# EAGLE design SparkFun_GNSS_NEO-M9N (EAGLE 9.6.2)
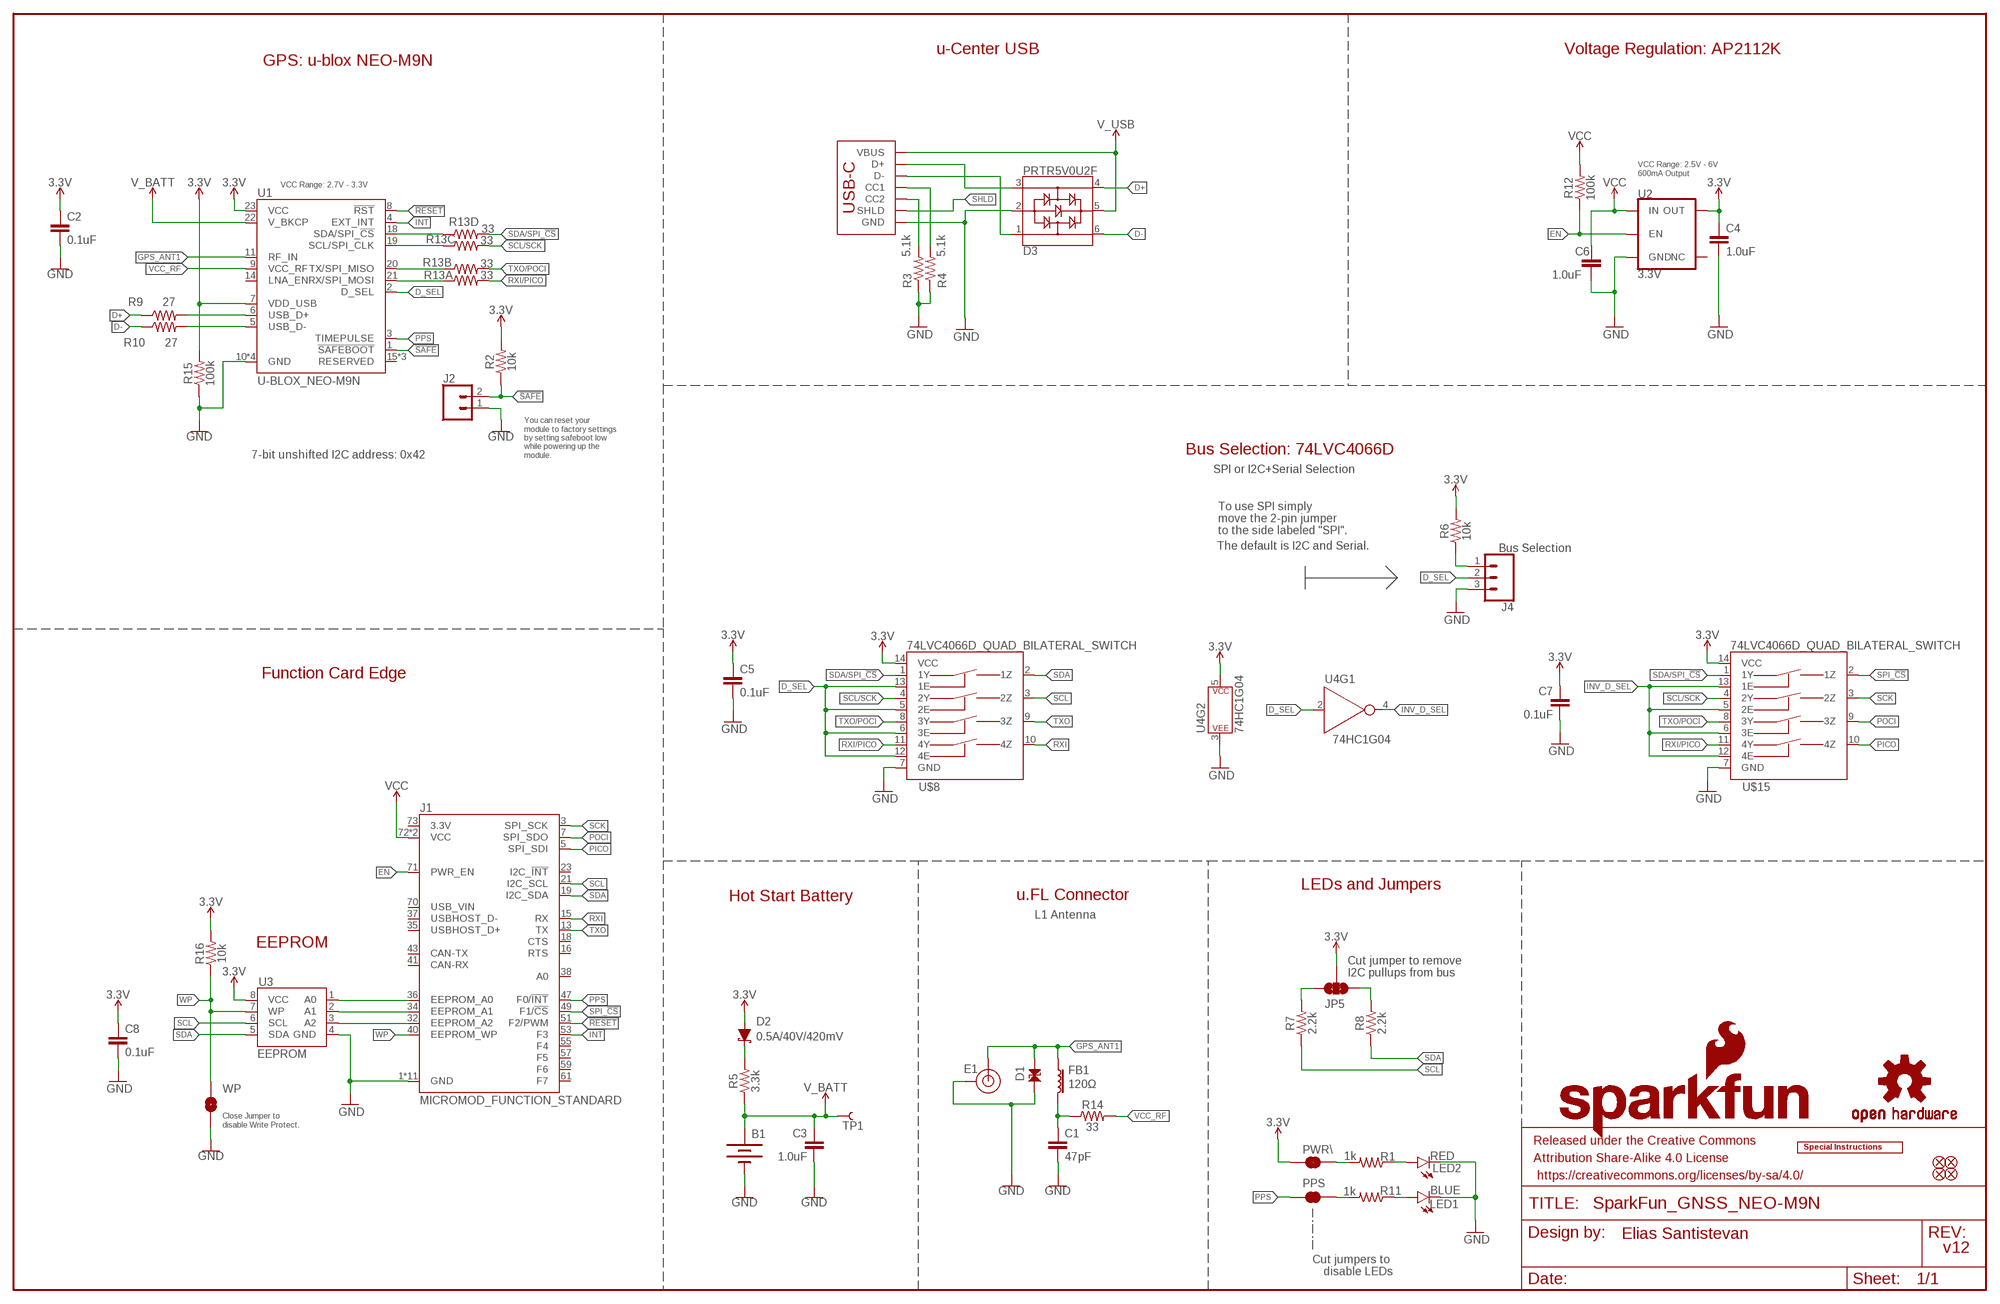
[diagram p0: schematic, sheet 1]

## Parts
B1  6.8MM_COIN_CELL  RELOWABLE_BATTERY_MS421R  [MS421R_IV03E]
C1  47pF  47PF-0402-25V-5%-X7R  [0402]
C2  0.1uF  0.1UF-0402T-16V-10%  [0402-TIGHT]
C3  1.0uF  1.0UF-0603-16V-10%  [0603]
C4  1.0uF  1.0UF-0603-16V-10%  [0603]
C5  0.1uF  0.1UF-0603-25V-(+80/-20%)  [0603]
C6  1.0uF  1.0UF-0603-16V-10%  [0603]
C7  0.1uF  0.1UF-0603-25V-(+80/-20%)  [0603]
C8  0.1uF  0.1UF-0603-25V-(+80/-20%)  [0603]
D1  PESD0402-0402T  [0402-TIGHT]
D2  0.5A/40V/420mV  DIODE-SCHOTTKY-PMEG4005EJ  [SOD-323]
D3  PRTR5V0U2F  [SOT886]
E1  U.FL  U.FL2PIN  [U.FL]
FB1  120Ω  FERRITE_BEAD-120_OHM-0402  [0402]
FD1  FIDUCIAL1X2  [FIDUCIAL-1X2]
FD2  FIDUCIAL1X2  [FIDUCIAL-1X2]
FD3  FIDUCIAL1X2  [FIDUCIAL-1X2]
FD4  FIDUCIAL1X2  [FIDUCIAL-1X2]
FRAME2  FRAME-LEDGER  [CREATIVE_COMMONS]
J1  MICROMOD_FUNCTION_STANDARD  [M.2-CARD-E-22_FUNCTION_STANDARD]
J2  CONN_02  [1X02]
J3  USB_C_2-LAYER_PADS  [USB-C-16P-2LAYER-PADS]
J4  Bus Selection  CONN_03LOCK  [1X03_LOCK]
JP5  JUMPER-SMT_3_2-NC_TRACE_SILK  [SMT-JUMPER_3_2-NC_TRACE_SILK]
LED1  BLUE  LED-BLUE0603  [LED-0603]
LED2  RED  LED-RED0603  [LED-0603]
LOGO1  SPECIAL_INSTRUCTIONS-ORDERING  [ORDERING_INSTRUCTIONS]
LOGO2  SFE_LOGO_NAME_FLAME.2_INCH  [SFE_LOGO_NAME_FLAME_.2]
LOGO3  OSHW-LOGOS  [OSHW-LOGO-S]
PPS  JUMPER-SMT_2_NC_TRACE_SILK  [SMT-JUMPER_2_NC_TRACE_SILK]
PWR\  JUMPER-SMT_2_NC_TRACE_SILK  [SMT-JUMPER_2_NC_TRACE_SILK]
R1  1k  1KOHM-0603-1/10W-1%  [0603]
R2  10k  10KOHM-0603-1/10W-1%  [0603]
R3  5.1k  5.1KOHM5.1KOHM-0603-1/10W-1%  [0603]
R4  5.1k  5.1KOHM5.1KOHM-0603-1/10W-1%  [0603]
R5  3.3k  3.3KOHM-0603-1/10W-1%  [0603]
R6  10k  10KOHM-0603-1/10W-1%  [0603]
R7  2.2k  2.2KOHM-0603-1/10W-1%  [0603]
R8  2.2k  2.2KOHM-0603-1/10W-1%  [0603]
R9  27  27OHM-0603-1/10W-1%  [0603]
R10  27  27OHM-0603-1/10W-1%  [0603]
R11  1k  1KOHM-0603-1/10W-1%  [0603]
R12  100k  100KOHM-0603-1/10W-1%  [0603]
R13  33  33OHM_RA-1206-1/16W-5%  [1206_RA]
R14  33  33OHM-0402-1/10W-1%  [0402]
R15  100k  100KOHM-0603-1/10W-1%  [0603]
R16  10k  10KOHM-0603-1/10W-1%  [0603]
TP1  TEST-POINT3X4  [PAD.03X.04]
U1  U-BLOX_NEO-M9N  [NEO-M9N/M8T/M8U/D9S]
U2  3.3V  V_REG_AP2112K-3.3V  [SOT23-5]
U3  EEPROM  EEPROM-I2C512K  [SO08]
U4  74HC1G04  [SOT353]
U$8  74LVC4066D_QUAD_BILATERAL_SWITCH  [SO14]
U$15  74LVC4066D_QUAD_BILATERAL_SWITCH  [SO14]
WP  JUMPER-SMT_2_NO_SILK  [SMT-JUMPER_2_NO_SILK]

## Nets
3.3V [3.3V]: C2.1 C4.1 C5.1 C7.1 C8.1 D2.A JP5.2 PWR\.2 R2.2 R6.2 R15.2 R16.2 U1.7(VDD_USB) U1.23(VCC) U2.5(OUT) U3.8(VCC) U4.5(P$V+) U$8.14(VCC) U$15.14(VCC)
!RESET: J1.51(F2/PWM) U1.8(!RST)
!SAFE: J2.2 R2.1 U1.1(!SAFEBOOT!)
A0: J1.36(EEPROM_A0) U3.1(A0)
A1: J1.34(EEPROM_A1) U3.2(A1)
A2: J1.32(EEPROM_A2) U3.3(A2)
D+: D3.4 R9.1
D-: D3.6 R10.1
D_SEL: J4.2 U1.2(D_SEL) U4.2(A) U$8.5(2E) U$8.6(3E) U$8.12(4E) U$8.13(1E)
EN: J1.71(PWR_EN) R12.1 U2.3(EN)
GND: B1.- C1.2 C2.2 C3.2 C4.2 C5.2 C6.2 C7.2 C8.2 D1.1 D3.2 E1.1(GND) E1.2(GND) J1.1(GND) J1.33(GND) J1.39(GND) J1.45(GND) J1.75(GND) J1.GND1(GND) J1.GND2(GND) J1.GND3(GND) J1.GND4(GND) J1.GND5(GND) J1.GND6(GND) J2.1 J3.GND J3.GND2(GND) J4.3 LED1.C LED2.C R3.1 R4.1 R15.1 U1.10(GND) U1.12(GND) U1.13(GND) U1.24(GND) U2.2(GND) U3.4(GND) U4.3(P$V-) U$8.7(GND) U$15.7(GND) WP.1
GPS_ANT1 [Antenna]: D1.2 E1.FEED(SIGNAL) FB1.1 U1.11(RF_IN)
INT: J1.53(F3) U1.4(EXT_INT)
INV_D_SEL: U4.4(Y) U$15.5(2E) U$15.6(3E) U$15.12(4E) U$15.13(1E)
N$1: PWR\.1 R1.2
N$2: LED1.A R11.1
N$3: C1.1 FB1.2 R14.1
N$4: PPS.1 R11.2
N$5: JP5.1 R8.2
N$6: D2.C R5.2
N$7: J3.A5(CC1) R4.2
N$8: JP5.3 R7.2
N$9: J3.B5(CC2) R3.2
N$10: LED2.A R1.1
N$11: R9.2 U1.6(USB_D+)
N$12: R10.2 U1.5(USB_D-)
N$13 [3.3V]: J4.1 R6.1
PICO: J1.5(SPI_SDI) U$15.10(4Z)
POCI: J1.7(SPI_SDO) U$15.9(3Z)
PPS: J1.47(F0/!INT!) PPS.2 U1.3(TIMEPULSE)
RXI: J1.15(RX) U$8.10(4Z)
RXI/PICO: R13.P8 U$8.11(4Y) U$15.11(4Y)
RXLV: R13.P1 U1.21(RX/SPI_MOSI)
SCK: J1.3(SPI_SCK) U$15.3(2Z)
SCL: J1.21(I2C_SCL) R7.1 U3.6(SCL) U$8.3(2Z)
SCL/SCK: R13.P6 U$8.4(2Y) U$15.4(2Y)
SCL_LV: R13.P3 U1.19(SCL/SPI_CLK)
SDA: J1.19(I2C_SDA) R8.1 U3.5(SDA) U$8.2(1Z)
SDA/SPI_!CS!: R13.P5 U$8.1(1Y) U$15.1(1Y)
SDA_LV: R13.P4 U1.18(SDA/SPI_!CS!)
SHLD: J3.SHLD1(SHLD) J3.SHLD2(SHLD) J3.SHLD3(SHLD) J3.SHLD4(SHLD)
SPI_!CS!: J1.49(F1/!CS!) U$15.2(1Z)
TXLV: R13.P2 U1.20(TX/SPI_MISO)
TXO: J1.13(TX) U$8.9(3Z)
TXO/POCI: R13.P7 U$8.8(3Y) U$15.8(3Y)
USB_D+: D3.3 J3.A6(D+) J3.B6(D+)
USB_D-: D3.1 J3.A7(D-) J3.B7(D-)
V_BATT: B1.+ C3.1 R5.1 TP1.1 U1.22(V_BKCP)
V_USB: D3.5 J3.VBUS1(VBUS) J3.VBUS2(VBUS)
VCC: C6.1 J1.72(VCC) J1.74(VCC) R12.2 U2.1(IN)
VCC_RF: R14.2 U1.9(VCC_RF)
WP: J1.40(EEPROM_WP) R16.1 U3.7(WP) WP.2
Unconnected: J1.16(RTS) J1.18(CTS) J1.23(I2C_!INT!) J1.35(USBHOST_D+) J1.37(USBHOST_D-) J1.38(A0) J1.41(CAN-RX) J1.43(CAN-TX) J1.55(F4) J1.57(F5) J1.59(F6) J1.61(F7) J1.70(USB_VIN) J1.73(3.3V) U1.14(LNA_EN) U1.15(RESERVED) U1.16(RESERVED) U1.17(RESERVED) U2.4(NC)

## Notes on the sheet
- u-Center USB | Voltage Regulation: AP2112K
- GPS: u-blox NEO-M9N
- VCC Range: 2.5V - 6V 
  600mA Output
- VCC Range: 2.7V - 3.3V
- 7-bit unshifted I2C address: 0x42 | Bus Selection: 74LVC4066D
- You can reset your 
  module to factory settings
  by setting safeboot low
  while powering up the
  module.
- SPI or I2C+Serial Selection
- To use SPI simply 
  move the 2-pin jumper
  to the side labeled "SPI".
- The default is I2C and Serial.
- Function Card Edge
- LEDs and Jumpers
- Hot Start Battery | u.FL Connector
- L1 Antenna
- EEPROM
- Cut jumper to remove 
  I2C pullups from bus
- Close Jumper to
  disable Write Protect.
- Elias Santistevan
- v12
- Cut jumpers to 
  disable LEDs

## Library data of the parts
B1 = SparkFun-Batteries:RELOWABLE_BATTERY: SEIKO Reflowable Lithium Batteries; PROD_ID: BAT-16685
C1 = SparkFun-Capacitors:47PF: 47pF ceramic capacitors A capacitor is a passive two-terminal electrical component used to store electrical energy temporarily in an electric field.; PROD_ID: CAP-15063
C2 = SparkFun-Capacitors:0.1UF: 0.1µF ceramic capacitors A capacitor is a passive two-terminal electrical component used to store electrical energy temporarily in an electric field.; PROD_ID: CAP-12416
C3 C4 C6 = SparkFun-Capacitors:1.0UF: 1µF ceramic capacitors A capacitor is a passive two-terminal electrical component used to store electrical energy temporarily in an electric field.; PROD_ID: CAP-00868
C5 C7 C8 = SparkFun-Capacitors:0.1UF: 0.1µF ceramic capacitors A capacitor is a passive two-terminal electrical component used to store electrical energy temporarily in an electric field.; PROD_ID: CAP-00810
D1 = SparkFun-DiscreteSemi:PESD0402: ESD protection diode PESD is used to protect a signal line from ESD.; PROD_ID: DIO-15359
D2 = SparkFun-DiscreteSemi:DIODE-SCHOTTKY: Schottky diode A Schottky diode is a semiconductor diode which has a low forward voltage drop and a very fast switching action.; PROD_ID: DIO-10955
D3 = SparkFun-IC-Power:PRTR5V0U2: A small ESD protection device. Most commonly used on USB D+/D- signals to protect large, expensive, or especially sensitive USB enabled devices.; PROD_ID: DIO-14084
E1 = SparkFun-Connectors:U.FL2PIN: SMD Antenna Connector - U.FL 2mm height, 3.0mm x 3.0mm receptacle size. SparkFun Products: SparkFun WiFi Shield - ESP8266 <https://www.sparkfun.com/products/13287> SparkFun ESP8266 Thing <https://www.sparkfun.com/products/13231> SparkFun MiniGen - Pro Mini Signal Generator Shield <https://www.sparkfun.com/products/11420>; PROD_ID: CONN-09193; SF_ID: WRL-09144
FB1 = SparkFun-Coils:FERRITE_BEAD-120_OHM: Ferrite Bead (blocks, cores, rings, chokes, etc.) Inductor with layers of ferrite used to suppress high frequencies. Often used to isolate high frequency noise.; MFG_PART: BLM15HB121SN1D; PROD_ID: NDUC-14206
FD1-FD4 = SparkFun-Aesthetics:FIDUCIAL: Fiducial Alignment Points Point-of-reference for pick-and-place machines and other optical instruments.
FRAME2 = SparkFun-Aesthetics:FRAME-LEDGER: Schematic Frame - Ledger Standard 11x14 US Ledger frame
J1 = SparkFun-MicroMod:MICROMOD_FUNCTION: MicroMod Connector Description: A card edge connector and mating PCB connector to allow various MicroMod Processor Boards to be coupled with various carrier boards of different capabilities. Based on the M.2 standard.
J2 = SparkFun-Connectors:CONN_02: Multi connection point. Often used as Generic Header-pin footprint for 0.1 inch spaced/style header connections On any of the 0.1 inch spaced packages, you can populate with these: Break Away Headers - Straight <https://www.sparkfun.com/products/116> (PRT-00116) Break Away Male Headers - Right Angle <https://www.sparkfun.com/products/553> (PRT-00553) Female Headers <https://www.sparkfun.com/products/115> (PRT-00115) Break Away Headers - Machine Pin <https://www.sparkfun.com/products/117> (PRT-00117) Break Away Female Headers - Swiss Machine Pin <https://www.sparkfun.com/products/743> (PRT-00743) For SCREWTERMINALS and SPRING TERMINALS visit here: Screw Terimnals on SparkFun.com <https://www.sparkfun.com/search/results?term=Screw+Terminals> (5mm/3.5mm/2.54mm spacing) This device is also useful as a general connection point to wire up your design to another part of your project. Our various solder wires solder well into these plated through hole pads. Hook-Up Wire - Assortment (Stranded, 22 AWG) <https://www.sparkfun.com/products/11375> (PRT-11375) Hook-Up Wire - Assortment (Solid Core, 22 AWG) <https://www.sparkfun.com/products/11367> (PRT-11367) View the entire wire category on our website here <https://www.sparkfun.com/categories/141> Special notes: Molex polarized connector foot print use with: PRT-08233 with associated crimp pins and housings. 2.54_SCREWTERM for use with PRT-10571. 3.5mm Screw Terminal footprints for PRT-08084 5mm Screw Terminal footprints for use with PRT-08432
J3 = SparkFun-Connectors:USB_C: USB Type C 16Pin Connector Super Speed pins not available on the 16-pin purely SMD connector so this part is best for USB 2.0 implementations. D1 and D2 are tied together enabling D+/- no matter which way the cable is plugged into the connector. The two channel configuration pins (CC1/2) are exposed. These are normally connected to ground via 5.1k resistors but can be reconfigured for high current/high power applications. **4-LAYER BOARD WARNING!!** If designing 4-layer board, make sure to select the variant _4-LAYER-ISOLATED. The linked footprint (USB-C-16-4LAYER-ISOLATED) includes some very necessary cutout polygons in the inner layers (2 and 15). This prevents the PTH mounting shield legs on the USB connector from electrically connecting any other polygons on the inner layers (usually VCC and GND).; PROD_ID: CONN-14122
J4 = SparkFun-Connectors:CONN_03: Multi connection point. Often used as Generic Header-pin footprint for 0.1 inch spaced/style header connections On any of the 0.1 inch spaced packages, you can populate with these: Break Away Headers - Straight <https://www.sparkfun.com/products/116> (PRT-00116) Break Away Male Headers - Right Angle <https://www.sparkfun.com/products/553> (PRT-00553) Female Headers <https://www.sparkfun.com/products/115> (PRT-00115) Break Away Headers - Machine Pin <https://www.sparkfun.com/products/117> (PRT-00117) Break Away Female Headers - Swiss Machine Pin <https://www.sparkfun.com/products/743> (PRT-00743) Stackable Header - 3 Pin (Female, 0.1") <https://www.sparkfun.com/products/13875> (PRT-13875) For SCREWTERMINALS and SPRING TERMINALS visit here: Screw Terimnals on SparkFun.com <https://www.sparkfun.com/search/results?term=Screw+Terminals> (5mm/3.5mm/2.54mm spacing) This device is also useful as a general connection point to wire up your design to another part of your project. Our various solder wires solder well into these plated through hole pads. Hook-Up Wire - Assortment (Stranded, 22 AWG) <https://www.sparkfun.com/products/11375> (PRT-11375) Hook-Up Wire - Assortment (Solid Core, 22 AWG) <https://www.sparkfun.com/products/11367> (PRT-11367) View the entire wire category on our website here <https://www.sparkfun.com/categories/141> Special notes: Molex polarized connector foot print use with SKU : PRT-08232 with associated crimp pins and housings.
JP5 = SparkFun-Jumpers:JUMPER-SMT_3_2-NC_TRACE: Normally closed trace jumper (2 of 2 connections) This jumper has a trace between all three pads so they are normally closed (NC). Use a razor knife to open the connection(s). For best results follow the IPC guidelines for cutting traces: Cutout at least 0.063 mm (0.005 in). Remove all loose material to clean up the cut area. Seal the cut with an approved epoxy. Reapply solder to reclose the connection(s).
LED1 = SparkFun-LED:LED-BLUE: Blue SMD LED Used in manufacturing of various products at SparkFun Packages: 0603 - SMD 0603 package [Product Link] <http://www.digikey.com/product-detail/en/SMLE12BC7TT86/511-1589-2-ND/1641808> 1206 - SMD1206 package [Product Link] <http://www.digikey.com/product-detail/en/lite-on-inc/LTST-C150TBKT/160-1643-1-ND/573584> SparkFun Products: ESP8266 Thing-Dev Board <https://www.sparkfun.com/products/13711> RedBoard <https://www.sparkfun.com/products/12757>; PROD_ID: DIO-08575
LED2 = SparkFun-LED:LED-RED: Red SMD LED Used in manufacturing of most products at SparkFun Packages: 0603 - SMD 0603 package [Product Link] <http://docs.avagotech.com/docs/AV02-0551EN> 0603 SMART - SMD 0603 SMART package ( more efficient and expensive)[Product Link] <http://www.osram-os.com/Graphics/XPic2/00077099_0.pdf> 1206 - SMD1206 package [Product Link] <https://www.sparkfun.com/datasheets/DevTools/LilyPad/Q150OVS4.pdff> SparkFun Products: Pro Mini 328 -5V <https://www.sparkfun.com/products/821> RedBoard <https://www.sparkfun.com/products/12757> IOIO-OTG <https://www.sparkfun.com/products/13613>; PROD_ID: DIO-00819
LOGO1 = SparkFun-Aesthetics:SPECIAL_INSTRUCTIONS: Special Ordering/Production Instructions Alert Symbol for special PCB ordering instructions or unique production process warnings. Ordering Instructions Production Instructions Types of information that should be added to box: Copper weight Soldermask color Silk color PCB thickness Number of layers PCB Standard: 1.6mm FR4 1 oz copper immersion silver plating red soldermask white silkscreen Types of information that should be added to box: Special wash requirements Depaneling instructions Humidification Glue curing Default text settings: 0.07 inch 9% ratio 50% line distance
LOGO2 = SparkFun-Aesthetics:SFE_LOGO_NAME_FLAME: SparkFun Font Logo w/ Flame This is the SparkFun full logo. The logo on the schematic will always be the same size; the package variant is the height of the flame part of the logo. Default layer for the logo on the board is tSilk.
LOGO3 = SparkFun-Aesthetics:OSHW-LOGO: Open-Source Hardware (OSHW) Logo This logo indicates the piece of hardware it is found on incorporates a OSHW license and/or adheres to the definition of open source hardware found here: http://freedomdefined.org/OSHW
PPS PWR\ = SparkFun-Jumpers:JUMPER-SMT_2_NC_TRACE: Normally closed trace jumper This jumper has a trace between two pads so it's normally closed (NC). Use a razor knife to open the connection. For best results follow the IPC guidelines for cutting traces: Cutout at least 0.063 mm (0.005 in). Remove all loose material to clean up the cut area. Seal the cut with an approved epoxy. Reapply solder to reclose the connection.
R1 R11 = SparkFun-Resistors:1KOHM: 1kΩ resistor A resistor is a passive two-terminal electrical component that implements electrical resistance as a circuit element. Resistors act to reduce current flow, and, at the same time, act to lower voltage levels within circuits. - Wikipedia; PROD_ID: RES-07856
R2 R6 R16 = SparkFun-Resistors:10KOHM: 10kΩ resistor A resistor is a passive two-terminal electrical component that implements electrical resistance as a circuit element. Resistors act to reduce current flow, and, at the same time, act to lower voltage levels within circuits. - Wikipedia; PROD_ID: RES-00824
R3 R4 = SparkFun-Resistors:5.1KOHM; PROD_ID: RES-12083
R5 = SparkFun-Resistors:3.3KOHM: 3.3kΩ resistor A resistor is a passive two-terminal electrical component that implements electrical resistance as a circuit element. Resistors act to reduce current flow, and, at the same time, act to lower voltage levels within circuits. - Wikipedia; PROD_ID: RES-07851
R7 R8 = SparkFun-Resistors:2.2KOHM: 2.2kΩ resistor A resistor is a passive two-terminal electrical component that implements electrical resistance as a circuit element. Resistors act to reduce current flow, and, at the same time, act to lower voltage levels within circuits. - Wikipedia; PROD_ID: RES-08272
R9 R10 = SparkFun-Resistors:27OHM: 27Ω resistor A resistor is a passive two-terminal electrical component that implements electrical resistance as a circuit element. Resistors act to reduce current flow, and, at the same time, act to lower voltage levels within circuits. - Wikipedia; PROD_ID: RES-09334
R12 R15 = SparkFun-Resistors:100KOHM: 100kΩ resistor A resistor is a passive two-terminal electrical component that implements electrical resistance as a circuit element. Resistors act to reduce current flow, and, at the same time, act to lower voltage levels within circuits. - Wikipedia; PROD_ID: RES-07828
R13 = SparkFun-Resistors:33OHM_RA: EXB-38V330JV Four Resistory Array - AEC-Q200 Certified; PROD_ID: RES-15081
R14 = SparkFun-Resistors:33OHM: 33Ω resistor A resistor is a passive two-terminal electrical component that implements electrical resistance as a circuit element. Resistors act to reduce current flow, and, at the same time, act to lower voltage levels within circuits. - Wikipedia; PROD_ID: RES-14883
TP1 = SparkFun-Connectors:TEST-POINT: SparkFun Test Points Bare copper test points for troubleshooting or In-Circuit-Testing. These are used by our Production team for verifying production board runs using pogo-pins on test beds. SparkFun Products: SparkFun LSM9DS1 Breakout <https://www.sparkfun.com/products/13284> SparkFun PSOC <https://www.sparkfun.com/products/13714> SparkFun Load Cell Amplifier <https://www.sparkfun.com/products/13879>
U1 = SparkFun-GPS:U-BLOX_NEO-M9N: u-blox NEO-M9N GPS Module The NEO-M9N module is built on the robust u-blox M9 GNSS chip, which provides exceptional sensitivity and acquisition times for all L1 GNSS systems. The u-blox M9 standard precision GNSS platform, which delivers meter-level accuracy, succeeds the well-known u-blox M8 product range. The receiver also provides higher navigation rate and improved security features compared to previous u-blox GNSS generations. The NEO-M9N module is available in the NEO form factor LLC package; PROD_ID: IC-14651
U2 = SparkFun-IC-Power:V_REG_AP2112: AP2112 - 600mA CMOS LDO Regulator w/ Enable The AP2112 is CMOS process low dropout linear regulator with enable function, the regulator delivers a guaranteed 600mA (min.) continuous load current. Features Output Voltage Accuracy: ±1.5% Output Current: 600mA (Min.) Foldback Short Current Protection: 50mA Enable Function to Turn ON/OFF VOUT Low Dropout Voltage (3.3V): 250mV (Typ.) @IOUT=600mA Excellent Load Regulation: 0.2%/A (Typ.) Excellent Line Regulation: 0.02%/V (Typ.) Low Quiescent Current: 55μA (Typ.) Low Standby Current: 0.01μA (Typ.) Low Output Noise: 50μVRMS PSRR: 100Hz -65dB, 1kHz -65dB OTSD Protection Stable with 1.0μF Flexible Cap: Ceramic, Tantalum and Aluminum Electrolytic Operation Temperature Range: -40°C to 85°C ESD: MM 400V, HBM 4000V; PROD_ID: VREG-12457
U3 = SparkFun-IC-Memory:EEPROM-I2C: I2C EEPROMs, 24LC256 and others 24LC256 Series 256 kb I2C 2 Wire (32 k x 8 Bit) 2.5 V Serial EEPROM SMD - SOIC-8 Datasheet SparkFun Products SparkFun UDB5 - PIC UAV Development Board <https://www.sparkfun.com/products/11703> (GPS-11703); PROD_ID: IC-14645
U4 = SparkFun-IC-Logic:74*1G04: Single Inverter IC NOT GATE INVERTER SNGL 1IN SOT353 Supply: 1.65V to 5.5V Datasheet <http://diodes.com/datasheets/74LVC1G04.pdf> SparkFun Products SparkFun Stepoko <https://www.sparkfun.com/products/13899> (ROB-13899) SparkFun CryptoShield <https://www.sparkfun.com/products/13183> (DEV-13183) SparkFun LogicBlocks Kit <https://www.sparkfun.com/products/11006> (KIT-11006) SparkFun ArduMoto <https://www.sparkfun.com/products/9815> (DEV-09815); PROD_ID: COMP-08268
U$8 U$15 = SparkFun-IC-Logic:74LVC4066D_QUAD_BILATERAL_SWITCH: Nexperia Quad Bilateral Switch The 74LVC4066 is a high-speed Si-gate CMOS device. The 74LVC4066 provides four single pole, single-throw analog switch functions. Each switch has two input/output terminals (nY and nZ) and an active HIGH enable input (nE). When nE is LOW, the analog switch is turned off. Schmitt-trigger action at the enable inputs makes the circuit tolerant of slower input rise and fall times across the entire VCC range from 1.65 V to 5.5 V. Datasheet <https://assets.nexperia.com/documents/data-sheet/74LVC4066.pdf>; PROD_ID: IC-13944
WP = SparkFun-Jumpers:JUMPER-SMT_2_NO: Normally open jumper This jumper has two pads in close proximity to each other. Apply solder to close the connection. Round pads are easier to solder for beginners, but are a lot larger. SparkFun Product that uses the round pads: SparkFun EL Sequencer <https://www.sparkfun.com/products/12781>

## Net classes
0 default: width 0.203 mm
1 vcc: width 0.254 mm
2 3.3V: width 0.203 mm
3 Antenna: width 1 mm, clearance 0.3 mm

## Board
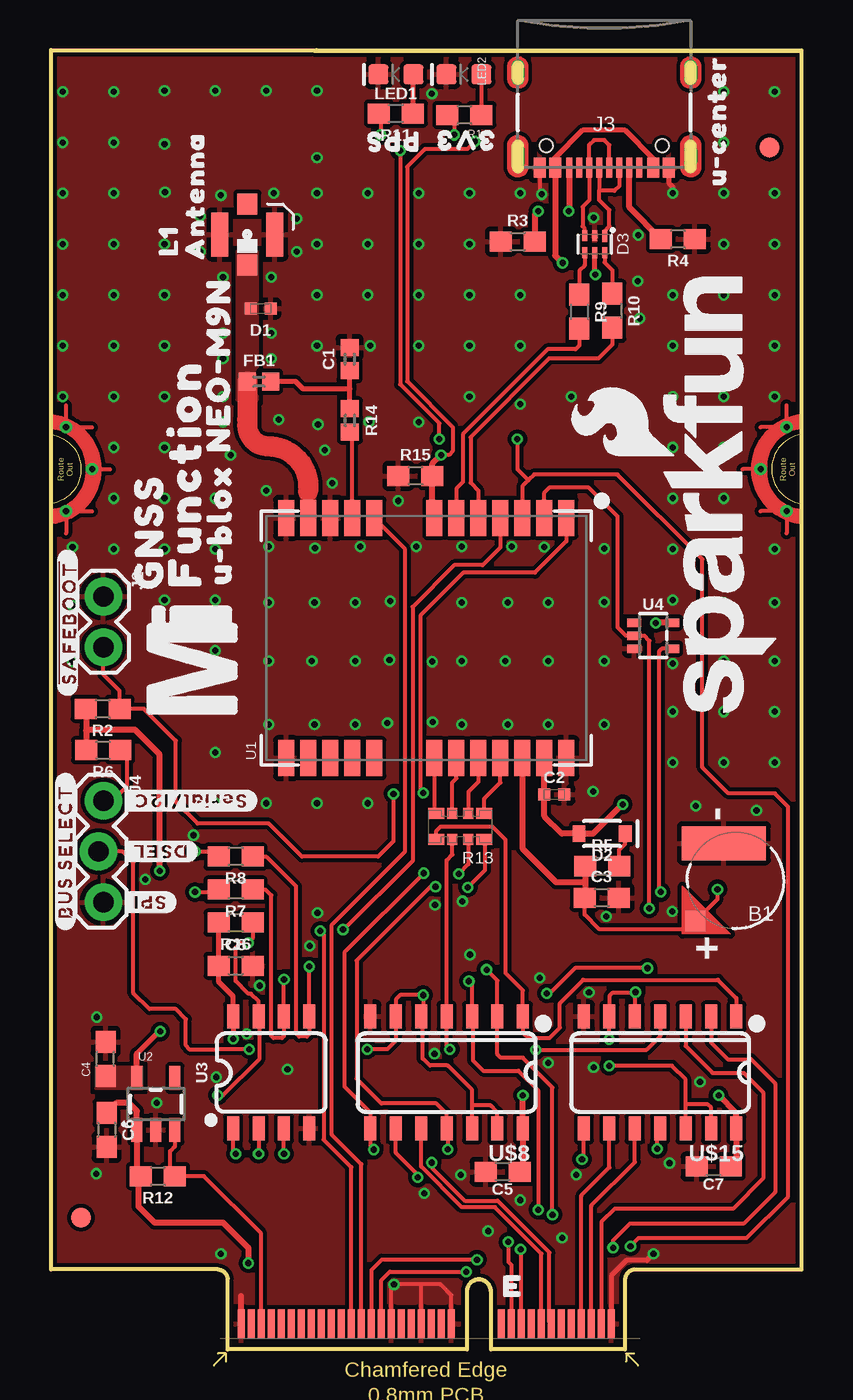
[diagram p1: board, top side]
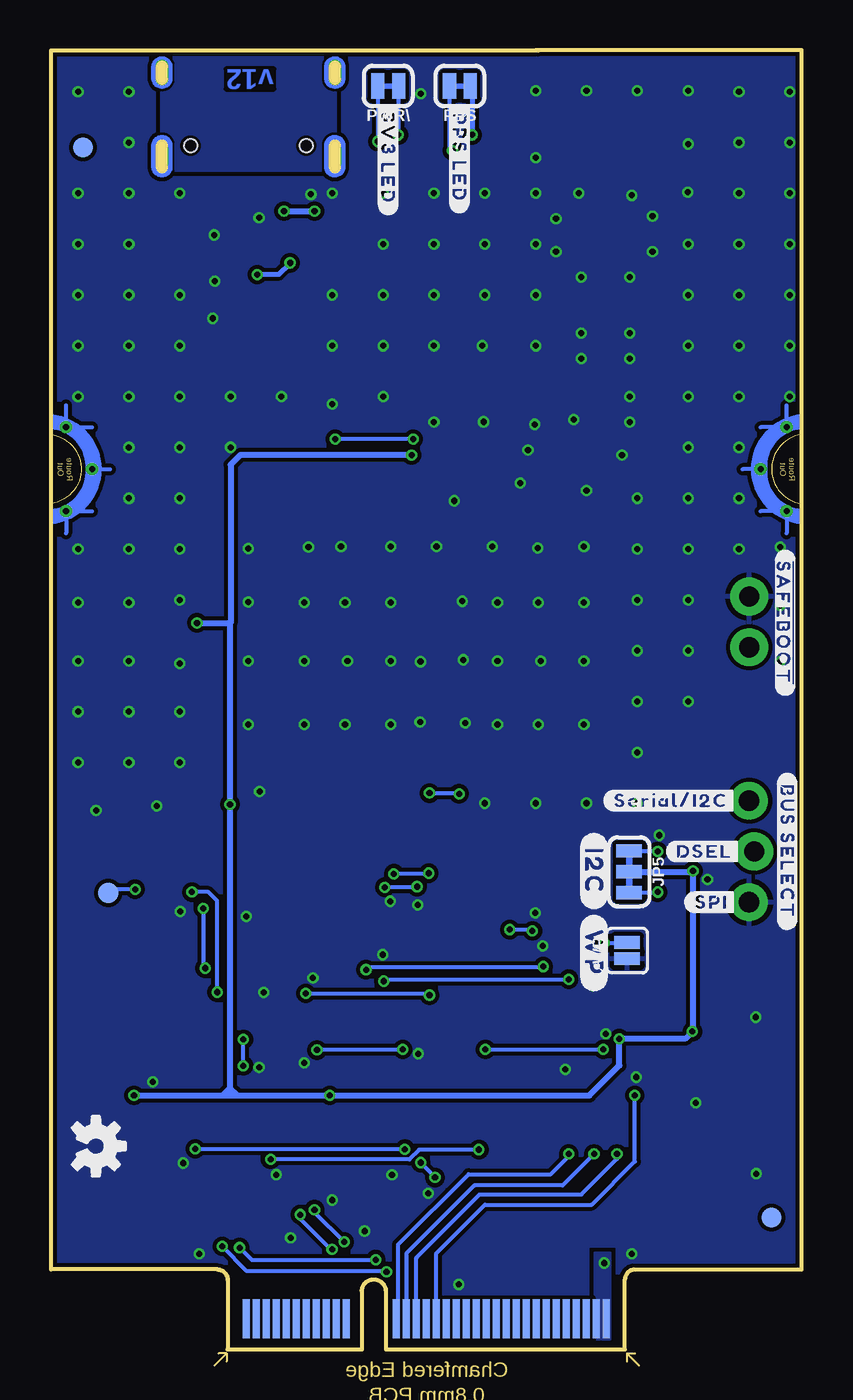
[diagram p2: board, bottom side, seen from below]

Size 37.5 x 64.95 mm. Coordinates in mm from the lower left corner, seen from the top.
Outline: 28.67,0 21.97,0 21.97,2.9 arc180 20.77,2.9 20.77,0 8.82,0 8.82,3.5 arc84 8.35,4 0,4 0,64.95 13.26,64.95 13.13,64.92 37.49,64.92 37.49,4 29.17,4 arc84 28.67,3.5 28.67,0
Copper layers (1*16): Top 0.035mm / dielectric 1.5mm / Bottom 0.035mm
Design rules "SparkFun-2-Layer-Minimum-JLCPCB": minimum track width 5mil, minimum drill 0.3mm, track to track 5mil, track to pad 5mil, pad to pad 5mil, via to via 5mil, smd to smd 5mil, copper to edge 7mil, drill to drill 7mil, minimum pad ring 5mil, minimum via ring 5mil, stop-mask expansion 2.5mil, vias tented up to drill 25mil, thermal gap 10mil

### Footprints (pad centres in the part's own frame; a part is rotated, then mirrored left to right if it is on the bottom)
MS421R_IV03E = smd 1 x 1: + 2.022,2.032 | smd 4.2 x 1.7: - 0.6,-1.85
0402 = smd 0.85 x 0.9: 1 -0.58,0; 2 0.58,0
0402-TIGHT = smd 0.6 x 0.6: 1 -0.5,0; 2 0.5,0
0603 = smd 1.1 x 1: 1 -0.85,0; 2 0.85,0
SOD-323 = smd 0.63 x 0.83: A 1.15,0; C -1.15,0
SOT886 = smd 0.61 x 0.25: 1 -0.405,0.5 | smd 0.56 x 0.25: 2 -0.43,0; 3 -0.43,-0.5; 4 0.43,-0.5; 5 0.43,0; 6 0.43,0.5
U.FL = smd 2.2 x 0.85: 1 0,1.375; 2 0,-1.375 | smd 1.05 x 1: FEED 1.525,0; NC -1.525,0
FIDUCIAL-1X2 = smd 1 x 1: 1 0,0
M.2-CARD-E-22_FUNCTION_STANDARD = smd 0.35 x 1.45: 1 9.25,1.275; 3 8.75,1.275; 5 8.25,1.275; 7 7.75,1.275; 9 7.25,1.275; 11 6.75,1.275; 13 6.25,1.275; 15 5.75,1.275; 17 5.25,1.275; 19 4.75,1.275; 21 4.25,1.275; 23 3.75,1.275; 33 1.25,1.275; 35 0.75,1.275; 37 0.25,1.275; 39 -0.25,1.275; 41 -0.75,1.275; 43 -1.25,1.275; 45 -1.75,1.275; 47 -2.25,1.275; 49 -2.75,1.275; 51 -3.25,1.275; 53 -3.75,1.275; 55 -4.25,1.275; 57 -4.75,1.275; 59 -5.25,1.275; 61 -5.75,1.275; 63 -6.25,1.275; 65 -6.75,1.275; 67 -7.25,1.275; 69 -7.75,1.275; 71 -8.25,1.275; 73 -8.75,1.275; 75 -9.25,1.275 | smd 0.35 x 1.95 bottom: 2 9,1.525; 4 8.5,1.525; 6 8,1.525; 8 7.5,1.525; 10 7,1.525; 12 6.5,1.525; 14 6,1.525; 16 5.5,1.525; 18 5,1.525; 20 4.5,1.525; 22 4,1.525; 32 1.5,1.525; 34 1,1.525; 36 0.5,1.525; 38 0,1.525; 40 -0.5,1.525; 42 -1,1.525; 44 -1.5,1.525; 46 -2,1.525; 48 -2.5,1.525; 50 -3,1.525; 52 -3.5,1.525; 54 -4,1.525; 56 -4.5,1.525; 58 -5,1.525; 60 -5.5,1.525; 62 -6,1.525; 64 -6.5,1.525; 66 -7,1.525; 68 -7.5,1.525; 70 -8,1.525; 72 -8.5,1.525; 74 -9,1.525 | drill 0.305 pad 0.61: GND1 -18,41.9; GND2 -16.7,44; GND3 -18,46.1; GND4 18,41.9; GND5 16.7,44; GND6 18,46.1
1X02 = drill 1.016 pad 1.88: 1 0,0; 2 2.54,0
USB-C-16P-2LAYER-PADS = smd 0.3 x 1: A5 -1.25,-0.34; A6 -0.25,-0.34; A7 0.25,-0.34; A8 1.25,-0.34; B5 1.75,-0.34; B6 0.75,-0.34; B7 -0.75,-0.34; B8 -1.75,-0.34 | smd 0.6 x 1: GND -3.225,-0.34; GND2 3.225,-0.34; VBUS1 -2.45,-0.34; VBUS2 2.45,-0.34 | drill 0.4 pad 0.6 long: SHLD1 -4.318,-0.915; SHLD2 4.318,-0.915; SHLD3 -4.318,-5.095; SHLD4 4.318,-5.095 | hole 0.65: -2.89,-1.445; 2.89,-1.445
1X03_LOCK = drill 1.016 pad 1.88: 1 0,0.127; 2 2.54,-0.127; 3 5.08,0.127
SMT-JUMPER_3_2-NC_TRACE_SILK = smd 0.66 x 1.27: 1 -1.041,0; 2 0,0; 3 1.041,0
LED-0603 = smd 1 x 1: A -0.877,0; C 0.877,0
SMT-JUMPER_2_NC_TRACE_SILK = smd 0.66 x 1.27: 1 -0.521,0; 2 0.521,0
1206_RA = smd 0.8 x 0.55: P1 -1.2,-0.62; P4 1.2,-0.62; P5 1.2,0.68; P8 -1.2,0.68 | smd 0.5 x 0.55: P2 -0.4,-0.62; P3 0.4,-0.62; P6 0.4,0.68; P7 -0.4,0.68
PAD.03X.04 = smd 1.016 x 1.016: 1 0,0
NEO-M9N/M8T/M8U/D9S = smd 1.8 x 0.8: 1 6,-7; 2 6,-5.9; 3 6,-4.8; 4 6,-3.7; 5 6,-2.6; 6 6,-1.5; 7 6,-0.4; 8 6,2.6; 9 6,3.7; 10 6,4.8; 11 6,5.9; 12 6,7; 13 -6,7; 14 -6,5.9; 15 -6,4.8; 16 -6,3.7; 17 -6,2.6; 18 -6,-0.4; 19 -6,-1.5; 20 -6,-2.6; 21 -6,-3.7; 22 -6,-4.8; 23 -6,-5.9; 24 -6,-7
SOT23-5 = smd 0.55 x 1.2: 1 -0.95,-1.3; 2 0,-1.3; 3 0.95,-1.3; 4 0.95,1.3; 5 -0.95,1.3
SO08 = smd 0.6 x 1.2: 1 -1.905,-2.8; 2 -0.635,-2.8; 3 0.635,-2.8; 4 1.905,-2.8; 5 1.905,2.8; 6 0.635,2.8; 7 -0.635,2.8; 8 -1.905,2.8
SOT353 = smd 0.42 x 0.7: 1 -0.65,-0.95; 2 0,-0.95; 3 0.65,-0.95; 4 0.65,0.95; 5 -0.65,0.95
SO14 = smd 0.6 x 1.2: 1 -3.175,-2.8; 2 -1.905,-2.8; 3 -0.635,-2.8; 4 0.635,-2.8; 5 1.905,-2.8; 6 3.175,-2.8; 7 4.445,-2.8; 8 4.445,2.8; 9 3.175,2.8; 10 1.905,2.8; 11 0.635,2.8; 12 -0.635,2.8; 13 -1.905,2.8; 14 -3.175,2.8
SMT-JUMPER_2_NO_SILK = smd 0.635 x 1.27: 1 -0.406,0; 2 0.406,0

### Placement (x,y rotation side)
B1  34.22,23.44 180 top
C1  14.92,49.5 90 top
C2  25.15,27.74 0 top
C3  27.51,22.58 0 top
C4  2.72,14.53 90 top
C5  22.56,8.89 180 top
C6  2.77,10.97 270 top
C7  33.1,9.14 180 top
C8  9.22,19.18 0 top
D1  10.47,52.03 180 top
D2  27.53,25.78 180 top
D3  27.15,55.24 270 top
E1  9.8,55.73 270 top
FB1  10.39,48.38 0 top
FD1  1.5,6.6 270 bottom
FD2  1.5,6.6 90 top
FD3  35.89,60.07 270 bottom
FD4  35.89,60.07 90 top
FRAME2  -2.84,-12.7 0 top  (outside the outline)
J1  18.75,0 0 top
J2  2.61,37.63 270 top
J3  27.64,58.72 180 top
J4  2.49,27.43 270 top
JP5  8.61,23.88 270 bottom
LED1  17.22,63.73 180 top
LED2  20.63,63.73 180 top
LOGO1  85.7,58.5 0 top  (outside the outline)
LOGO2  33.38,42.8 90 top
LOGO3  35.26,10.16 270 bottom
PPS  17.07,63.14 180 bottom
PWR\  20.65,63.14 180 bottom
R1  20.65,61.7 180 top
R2  2.58,32.02 180 top
R3  23.32,55.37 0 top
R4  31.32,55.5 180 top
R5  27.53,24.16 0 top
R6  2.6,29.95 180 top
R7  9.22,22.99 180 top
R8  9.22,24.64 180 top
R9  26.39,51.87 270 top
R10  28.04,51.92 270 top
R11  17.22,61.77 180 top
R12  5.34,8.66 180 top
R13  20.45,26.16 180 top
R14  14.93,46.43 270 top
R15  18.2,43.66 0 top
R16  9.22,21.34 180 top
TP1  34.65,22.81 180 bottom
U1  18.75,35.56 90 top
U2  5.23,12.27 0 top
U3  11,13.84 0 top
U4  30.08,35.68 270 top
U$1  [3V313]  20.65,60.45 180 top
U$2  [PPS13]  17.02,60.38 180 top
U$3  [FUNCTION521]  6.68,43.76 90 top
U$4  [##SAFEBOOT##882188213]  0.81,36.32 90 top
U$5  [U#BLOX11]  8.43,41.25 90 top
U$6  [NEO#M9N12]  8.36,49.2 90 top
U$7  [ANTENNA14]  7.19,57.66 90 top
U$8  20.4,13.84 180 top
U$9  [U#CENTER15]  33.26,61.41 90 top
U$10  [#I2C#18]  10.37,23.91 270 bottom
U$11  [MICROMOD_MI_LOGO_1]  7.01,34.49 90 top
U$12  [#3V3_LED#403132222514]  20.65,59.56 270 bottom
U$13  [#PPS_LED#403132222514]  17.1,59.56 270 bottom
U$14  [L1321542]  5.87,55.42 90 top
U$15  31.07,13.84 180 top
U$16  [#SPI#40313521]  4.9,22.35 180 top
U$17  [#SERIAL#I2C#40313523]  6.94,27.43 180 top
U$18  [#BUS_SELECT#509]  0.71,24.89 90 top
U$19  [#DSEL#40313522]  5.41,24.89 180 top
U$20  [#WP#13215403132222564]  10.36,19.81 270 bottom
U$21  [GNSS2222502]  4.9,40.89 90 top
U$22  [#BUS_SELECT#509]  0.71,24.89 270 bottom
U$23  [##SAFEBOOT##882188213]  0.81,36.32 270 bottom
U$24  [#SPI#40313521]  4.5,22.35 0 bottom
U$25  [#DSEL#40313522]  4.85,24.89 0 bottom
U$26  [#SERIAL#I2C#40313523]  6.53,27.43 0 bottom
WP  8.71,19.94 90 bottom

### Tracks (layer width: path | path; a pad name or v marks a point on that pad's centre or on a via)
3.3V  (via drill 0.3)
  Top 0.203: v21.17,60.38 20.8,60 18.68,60 17.79,59.11 17.79,48.39 20.07,46.11 20.07,44.89 19.88,44.7 v19.48,44.7
  Top 0.254: 4.28,14.78 5.39,15.89 | R16.2 C8.1 8.37,18.38 9.09,17.65 U3.8 v9.1,15.53
  Top 0.305: U1.23 C2.1 24.65,26.65 25.52,25.78 D2.A 27.08,25.78 28.54,27.25 v28.56,27.25 | U1.7 19.05,41.66 R15.2 19.05,44.27 v19.48,44.7 | v33.35,12.7 34.24,11.81 U$15.14 34.24,9.44 C7.1 | U2.5 4.28,14.78 | v23.57,12.7 U$8.14 23.57,9.06 C5.1 | v5.42,23.91 5.42,29.74 4.2,30.96 1.8,30.96 1.75,30.91 | U4.5 30.22,36.33 v30.2,36.31 | R2.2 1.75,32 1.75,30.91 | 1.75,30.91 R6.2 | 5.39,15.89 v5.46,15.89
  Bottom 0.203: PWR\.2 v21.17,60.38
  Bottom 0.305: v19.48,44.7 28.04,44.7 28.53,44.22 28.53,36.31 28.56,36.31 | v33.35,12.7 28.91,12.7 | 28.91,12.7 28.56,12.7 | 28.56,12.7 28.18,12.7 | 28.18,12.7 v23.57,12.7 10.6,12.7 9.1,14.19 v9.1,15.53 5.82,15.53 v5.46,15.89 5.43,15.92 v5.43,23.91 v5.42,23.91 5.46,23.88 JP5.2 | 28.56,36.31 v28.56,27.25 28.56,13.08 | 28.56,13.05 28.56,12.7 | v30.2,36.31 28.56,36.31 | 28.18,12.7 28.56,13.08 | 28.91,12.7 28.56,13.05 | 28.56,13.05 28.56,13.08
  pour Top (isolate 0.305, no thermals): 2.24,13.03 4.55,13.03 4.55,14.12 2.24,14.12
!RESET
  Top 0.203: J1.51 15.5,9.26 14.03,10.73 14.03,21.22 17.67,24.86 17.67,40.04 U1.8
!SAFE  (via drill 0.3)
  Top 0.203: U1.1 25.75,40.4 24.18,38.83 20.6,38.83 18.45,36.68 18.45,27.95 v18.59,27.81 | v17.11,27.77 17.11,25.4 16.34,24.64 12.52,24.64 10.87,26.29 7.32,26.29 6.24,27.37 6.24,30.42 4.63,32.02 R2.1 3.43,32.91 2.61,33.73 J2.2
  Bottom 0.203: v18.59,27.81 17.15,27.81 v17.11,27.77
A0  (via drill 0.3)
  Top 0.203: v9.22,9.78 9.09,9.91 U3.1
  Bottom 0.203: J1.36 19.25,4.58 16.08,7.75 11,7.75 9.22,9.53 v9.22,9.78
A1  (via drill 0.3)
  Top 0.203: U3.2 v10.36,9.78
  Bottom 0.203: v10.36,9.78 11.94,8.2 16.34,8.2 19.75,4.8 J1.34
A2  (via drill 0.3)
  Top 0.203: v11.63,9.78 U3.3
  Bottom 0.203: J1.32 20.15,1.62 20.15,5.25 16.63,8.76 12.52,8.76 11.63,9.65 v11.63,9.78
D+
  Top 0.203: D3.4 26.65,54.18 26.39,53.92 R9.1
D-
  Top 0.203: D3.6 27.65,54.33 28.04,53.94 R10.1
D_SEL  (via drill 0.3)
  Top 0.203: U1.2 24.65,42.84 24.88,43.07 26.87,43.07 28.31,41.63 28.31,36.09 28.72,35.68 U4.2 29.64,35.68 29.9,35.42 29.9,22.05 v29.89,22.04 | v29.8,19.06 26.18,19.06 24.92,17.8 v24.77,17.8 | 18.57,16.72 18.59,16.74 v18.59,17.71 17.45,17.71 17.22,17.49 U$8.6 17.22,15.43 16.8,15 v15.8,15 | 18.57,16.72 U$8.5 | U$8.12 21.03,12.2 | 21.03,12.2 21.03,12.97 19.82,14.19 18.92,14.19 18.57,14.54 18.57,16.72 | U$8.13 22.3,11.85 21.96,12.2 21.03,12.2 | v9.91,15 8.3,15 8.28,14.99 6.94,14.99 6.73,15.19 6.73,16.51 6.23,17.02 4.9,17.02 4.11,17.81 4.11,24.36 3.57,24.89 J4.2
  Bottom 0.203: v29.89,22.04 29.89,19.15 v29.8,19.06 | v24.77,17.8 24.73,17.76 18.64,17.76 v18.59,17.71 | v15.8,15 v9.91,15
EN
  Top 0.203: 5.94,8.66 5.94,9.91 6.18,10.15 U2.3 | J1.71 10.5,5.8 7.64,8.66 R12.1
  Top 0.305: 5.94,8.66 R12.1
GND  (via drill 0.3)
  Top 0.203: J1.GND2 2.05,43.2 J1.GND1 | J3.GND2 24.41,57.84 v24.51,57.73 | J1.33 20,2.71 19.46,3.25 18.49,3.25 | J1.39 18.5,3.25 18.49,3.25 | J1.GND5 35.19,44.25 35.19,44.8 36.49,46.1 J1.GND6 | 18.49,3.25 v17.13,3.25 17,3.11 J1.45
  Top 0.254: J3.GND 30.86,58.3 31.07,58.1 v31.07,57.78 | v30.1,4.78 29.76,4.45 28.75,4.45 28,3.69 J1.1
  Top 0.305: J1.75 9.5,2.66
  other vias: 27.1,56.57 10.87,31.24 24.84,31.24 13.18,40.06 10.87,40.13 13.16,31.24 10.87,34.42 10.87,37.34 13.16,37.34 13.03,34.42 15.19,31.24 15.19,34.42 15.19,37.34 15.44,40.13 17.35,42.42 18.24,40.13 20.52,40.13 23.01,40.13 24.63,40.11 24.84,37.34 24.84,34.42 22.81,31.24 20.52,31.24 19.06,31.36 19.04,34.38 20.52,37.34 22.81,37.34 22.68,34.42 20.52,34.42 5.69,57.84 10.75,42.93 13.33,46.24 29.34,55.7 29.41,51.54 27.64,31.24 27.64,34.42 27.64,37.36 27.64,40.03 27.08,27.89 29.31,53.39 2.29,16.61 2.26,8.79 5.28,12.32 8.49,4.78 1.07,40.11 33.61,37.34 33.61,34.42 1.07,37.19 5.67,60.25 8.49,57.68 1.07,34.39 33.61,40.01 20.46,8.73 30.9,9.31 16.95,37.4 16.9,34.47 16.8,31.32 21.83,5.92 26.88,17.85 32.22,27.16 35.25,26.94 7.11,25.7 11.81,14 12.93,20.17 20.93,19.74 19.18,22.23 20.55,22.4 18.65,7.8 25.53,5.59 27.1,14.1 4.7,23.5 24.84,14.33 24.41,18.57 31.04,21.89 33.61,42.55 33.61,45.09 33.61,47.62 33.61,50.16 33.61,52.7 36.15,52.7 33.61,55.24 33.61,57.78 33.61,60.33 33.61,62.87 36.15,62.87 36.15,57.78 36.15,55.24 36.15,50.16 36.15,47.62 36.15,37.34 36.15,40.01 36.15,34.42 31.07,45.09 28.53,45.09 31.07,47.62 31.07,50.16 28.53,47.62 25.99,47.62 31.07,52.7 31.07,42.55 23.45,47.24 20.91,47.62 20.91,50.16 20.91,52.7 20.91,55.24 20.91,57.78 23.45,50.16 23.45,52.7 23.45,57.78 18.37,55.24 18.37,52.7 18.37,50.16 15.95,50.16 15.83,52.7 15.83,55.24 15.83,57.78 18.37,57.78 15.89,46.37 18.37,46.35 13.29,50.16 13.29,52.7 13.29,55.24 8.59,53.59 8.97,44.7 11.38,46.48 14.05,43.31 13.67,44.96 7.44,56.64 13.29,57.78 11.13,57.78 12.27,56.52 11,53.59 8.59,50.8 11,50.8 11,49.53 8.59,49.53 8.59,47.62 8.59,46.35 31.07,40.01 31.07,37.47 31.07,34.29 36.15,31.88 33.61,31.88 31.07,31.88 31.07,29.34 33.61,29.34 36.15,29.34 5.67,52.7 5.67,50.16 5.67,47.62 5.67,45.09 5.67,42.55 5.67,40.01 5.67,37.47 5.67,34.92 5.67,32.38 3.13,40.01 3.13,42.55 3.13,45.09 3.13,47.62 3.13,50.16 3.13,52.7 3.13,55.24 0.59,47.62 0.59,50.16 0.59,52.7 0.59,55.24 0.59,57.78 0.59,60.33 0.59,62.87 3.13,62.87 3.13,57.78 3.13,60.33 5.67,55.24 8.21,29.84 8.21,32.38 8.21,34.92 8.21,37.47 8.21,40.01 8.21,42.55 8.21,27.3 10.75,27.3 13.29,27.3 15.83,27.3 19.15,14.78 8.26,13.61 9.78,15.77 26.24,8.74 23.45,7.47 13.31,21.82 10.42,18.19 5.67,62.92 13.29,59.56 32.42,13.38 27.74,21.64 19.03,62.76 8.21,62.92 10.75,62.92 13.29,62.92 7.44,54.86 12.27,54.86
  pour Top (isolate 0.203, rank 4): 0,0 37.54,0 37.54,64.95 0,64.95
  pour Bottom (isolate 0.203, rank 4): 0,0 37.54,0 37.54,64.95 0,64.95
GPS_ANT1
  Top 1: FB1.1 9.81,46.51 arc-90 9.8,46.5 9.8,46.2 arc90 10.86,45.14 arc-90 12.85,43.15 12.85,42.89
  pour Top (isolate 0.305, no thermals): 12.45,41.48 13.21,41.48 13.21,43 12.45,43
  pour Top (isolate 0.305, no thermals): 9.3,47.5 10.3,47.5 10.3,54.85 9.3,54.85
INT  (via drill 0.3)
  Top 0.203: J1.53 15,9.11 13.62,10.49 13.62,20.75 v13.45,20.92 | U1.4 22.45,40.09 21.56,39.2 20.14,39.2 18.06,37.12 18.06,24.41 14.61,20.96 v14.58,20.98
  Bottom 0.203: v14.58,20.98 13.51,20.98 v13.45,20.92
INV_D_SEL  (via drill 0.3)
  Top 0.203: U$15.12 31.7,12.25 | 31.7,12.25 31.7,13.5 31.02,14.18 v27.89,14.18 | v27.89,15.5 U$15.6 | U$15.6 | U4.4 30.52,35.03 30.39,34.91 30.39,22.93 v30.46,22.86 | 29.16,17.82 U$15.5 | v29.2,17.86 29.16,17.82 | 29.16,17.82 28.05,17.82 27.89,17.66 U$15.6 | U$15.13 32.97,12.1 32.82,12.25 31.7,12.25
  Bottom 0.203: v27.89,14.18 v27.89,15.5 | v29.2,17.86 29.2,22.42 29.64,22.86 v30.46,22.86
N$1  (via drill 0.3)
  Top 0.203: R1.2 20.14,61.35 v20.14,60.71
  Bottom 0.203: 20.14,63.13 v20.14,60.71
  Bottom 0.254: PWR\.1 20.14,63.13
N$2
  Top 0.254: LED1.A 18.07,63.7 R11.1
N$3
  Top 0.254: R14.1 14.93,48 | 14.93,48 C1.1 | FB1.2 12.22,48.38 12.6,48 14.93,48
N$4  (via drill 0.3)
  Top 0.203: R11.2 16.46,61.69 v16.46,60.71
  Bottom 0.203: v16.45,60.72 v16.46,60.71
  Bottom 0.254: PPS.1 16.45,63.04 v16.45,60.72
N$5  (via drill 0.3)
  Top 0.203: v7.19,24.89 8.12,24.89 R8.2
  Bottom 0.203: JP5.1 7.21,24.92 v7.19,24.89
N$6
  Top 0.203: R5.2 28.38,24.97 28.68,25.27 D2.C
N$7
  Top 0.305: R4.2 28.89,57.08 J3.A5
N$8  (via drill 0.3)
  Top 0.203: v7.19,22.86 8.24,22.86 R7.2
  Bottom 0.203: JP5.3 7.21,22.84 v7.19,22.86
N$9  (via drill 0.3)
  Top 0.305: J3.B5 25.89,56.92 v25.86,56.9 | v24.34,56.9 24.17,56.73 R3.2
  Bottom 0.305: v25.86,56.9 v24.34,56.9
N$10
  Top 0.203: R1.1 LED2.A
N$11
  Top 0.203: U1.6 20.25,43.03 20.58,43.36 20.58,45.75 24.81,49.99 26.2,49.99 26.39,50.17 R9.2
N$12
  Top 0.203: U1.5 21.35,42.93 20.96,43.32 20.96,45.59 24.9,49.54 27.35,49.54 28.04,50.23 R10.2
N$13
  Top 0.203: J4.1 3.05,27.43 3.8,28.18 3.8,29.61 R6.1
PICO
  Top 0.203: J1.5 27,7.2 29.16,9.36 U$15.10
POCI
  Top 0.203: J1.7 26.5,7.7 27.89,9.09 U$15.9
PPS  (via drill 0.3)
  Top 0.203: U1.3 23.55,43.15 23.85,43.45 | J1.47 16.5,3.46 16.93,3.89 v20.74,3.89 | v28.95,5.16 29.36,5.57 34.75,5.57 36.82,7.64 36.82,27.13 36.16,27.79 33.84,27.79 32.53,29.09 32.53,39.5 28.29,43.74 24.14,43.74 23.85,43.45 | v17.44,59.92 17.44,48.25 19.4,46.29 v19.4,45.5 | v23.3,45.5 23.3,44 23.85,43.45
  Bottom 0.203: v20.74,3.89 20.74,3.92 27.71,3.92 v28.95,5.16 | PPS.2 17.59,60.07 v17.44,59.92 | v19.4,45.5 v23.3,45.5
RXI
  Top 0.203: J1.15 24.5,4.79 22.18,7.11 20.52,7.11 18.49,9.14 U$8.10
RXI/PICO  (via drill 0.3)
  Top 0.203: R13.P8 21.67,25.46 21.67,23.94 v20.82,23.1 | v19.21,23.13 18.95,23.13 15.26,19.44 15.26,13.54 16.5,12.3 19.25,12.3 19.76,11.78 U$8.11 19.82,10.99 v19.82,10.01 | v30.29,10.03 30.29,10.9 U$15.11
  Bottom 0.203: v19.21,23.13 19.22,23.12 20.8,23.12 v20.82,23.1 | v19.82,10.01 30.27,10.01 v30.29,10.03
RXLV
  Top 0.203: U1.21 22.45,28.34 21.65,27.54 R13.P1
SCK
  Top 0.203: U$15.3 31.7,15.17 33.05,13.82 34.61,13.82 35.58,12.85 35.58,8.55 34.07,7.04 28.17,7.04 27.5,6.37 J1.3
SCL  (via drill 0.3)
  Top 0.203: v22.84,5.38 22.84,4.38 23,4.23 J1.21 | v24.34,6.99 24.34,12.94 23.34,13.93 21.58,13.93 21.07,14.45 21.07,16.61 U$8.3 21.03,18.25 v20.88,18.41 | v11.63,18.5 U3.6 11.63,15.67 11.53,15.57 11.1,15.57 11,15.67 11,22.69 10.71,22.99 R7.1
  Bottom 0.203: v24.34,6.99 24.34,6.87 v22.84,5.38 | v20.88,18.41 20.79,18.5 v11.64,18.5 v11.63,18.5
SCL/SCK  (via drill 0.3)
  Top 0.203: R13.P6 20.05,24.73 19.76,24.44 U$8.4 19.76,15.16 v19.92,15 | U$15.4 30.43,15.65 29.76,14.98 24.22,14.98 v24.21,14.97
  Bottom 0.203: v19.92,15 19.95,14.97 v24.21,14.97
SCL_LV
  Top 0.203: U1.19 20.25,28.55 20.05,28.35 R13.P3
SDA  (via drill 0.3)
  Top 0.203: J1.19 23.5,4.97 v23.46,5.01 | v25.05,6.74 25.05,13.1 23.57,14.58 22.48,14.58 22.3,14.75 U$8.2 22.3,18.44 v21.76,18.98 | v12.9,19.14 U3.5 12.9,15.77 12.78,15.65 12.4,15.65 12.24,15.8 12.24,23.14 10.75,24.64 R8.1
  Bottom 0.203: v23.46,5.01 23.53,5.01 25.05,6.53 v25.05,6.74 | v21.76,18.98 21.63,19.11 12.94,19.11 v12.9,19.14
SDA/SPI_!CS!
  Top 0.203: R13.P5 19.25,25.92 19.47,26.14 22.05,26.14 22.71,25.47 22.71,18.8 23.57,17.94 U$8.1 23.57,15.83 23.84,15.57 24.91,15.57 25.42,16.08 25.42,17.31 26.59,18.48 33.32,18.48 34.24,17.56 U$15.1
SDA_LV
  Top 0.203: U1.18 19.15,26.82 19.18,26.85 R13.P4
SHLD
  pour Top: 23.29,58.98 23.29,64.9 31.96,64.9 31.96,58.98
  pour Bottom: 23.29,58.98 23.29,64.9 31.96,64.9 31.96,58.98
SPI_!CS!  (via drill 0.3)
  Top 0.203: U$15.2 32.97,15.33 33.8,14.5 34.98,14.5 36.17,13.31 36.17,7.87 34.59,6.29 28.92,6.29 28.08,5.45 v28.08,5.09 | v21.28,4.49 16.52,4.49 16,3.96 J1.49
  Bottom 0.203: v28.08,5.09 27.46,4.47 21.3,4.47 v21.28,4.49
TXLV
  Top 0.203: R13.P2 20.85,27.87 21.35,28.37 U1.20
TXO  (via drill 0.3)
  Top 0.203: J1.13 24.9,1.37 24.9,4.85 22.31,7.44 20.66,7.44 19.02,9.08 v19.02,9.34 | v18.31,8.6 18.31,8.74 17.22,9.83 U$8.9
  Bottom 0.203: v19.02,9.34 18.31,8.63 v18.31,8.6
TXO/POCI  (via drill 0.3)
  Top 0.203: R13.P7 20.85,24.26 v20.37,23.77 | v18.62,23.8 14.66,19.84 14.66,13.14 15.95,11.84 U$8.8 15.95,10.16 v16.12,9.99 | v26.53,9.5 26.62,9.59 U$15.8
  Bottom 0.203: v18.62,23.8 18.65,23.77 v20.37,23.77 | v16.12,9.99 19.11,9.99 19.6,9.5 v26.53,9.5
USB_D+
  Top 0.203: J3.A6 27.89,60.2 27.64,60.45 27.13,60.45 26.88,60.2 26.88,59.08 J3.B6 26.89,57.44 26.55,57.11 26.55,56.13 26.65,56.03 D3.3
USB_D-
  Top 0.203: J3.A7 27.39,57.91 | 27.39,57.91 27.39,57.45 27.89,56.95 27.89,56.13 27.65,55.9 D3.1 | J3.B7 28.39,58.15 28.14,57.91 27.39,57.91
V_BATT  (via drill 0.3)
  Top 0.203: C3.1 26.66,21.74 27.4,21 31.78,21 B1.+ 33.3,22.52 v33.3,23
  Top 0.305: R5.1 26.68,23.37 | 26.68,23.37 26.68,22.61 C3.1 | U1.22 23.55,25.05 25.22,23.37 26.68,23.37
  Bottom 0.203: v33.3,23 34.46,23 TP1.1
V_USB  (via drill 0.3)
  Top 0.254: v27.2,53.72 27.15,53.77 D3.5 | J3.VBUS1 30.09,59.53 28.65,60.96 26.57,60.96 25.19,59.58 J3.VBUS2
  Top 0.305: J3.VBUS2 25.19,54.67 v25.55,54.3
  Bottom 0.254: v27.2,53.72 26.14,53.72 v25.55,54.3
VCC  (via drill 0.3)
  Top 0.305: C6.1 3.27,12.32 3.89,12.32 4.28,11.92 U2.1 4.28,8.86 R12.2 4.36,8.53 4.36,7.15 5.16,6.35 8.59,6.35 9.86,5.08 v9.86,4.32
  pour Bottom (isolate 0.305, no thermals): 9.55,0.51 9.55,4.83 10.34,4.83 10.34,0.51
VCC_RF
  Top 0.203: U1.9 15.05,45.73 R14.2
WP  (via drill 0.3)
  Top 0.203: v8.33,12.7 8.59,12.7 10.42,14.53 10.42,16.59 U3.7 10.36,17.4 9.98,17.78 9.86,17.78 9.22,18.41 9.22,20.08 9.46,20.32 v9.86,20.32 10.07,20.54 R16.1
  Bottom 0.203: J1.40 18.25,4.82 15.83,7.24 10.49,7.24 8.33,9.4 v8.33,12.7 | v9.86,20.32 8.74,20.32 WP.2

### Text on the board
Bottom: v12
tPlace: - | +
Measures: Units in Inches
tDocu: 0.8mm Thickness / 45 degree chamfered edge / ENIG Finish / MicroMod | Elias Santistevan